# Altium schematic sheet Alimentacion.SchDoc: Fuente de alimentación
size A4; Address1: Medidor de energia PROSER; Address2: MEI-300V; DocumentNumber: 1; Revision: 01; SheetNumber: 1; SheetTotal: 6
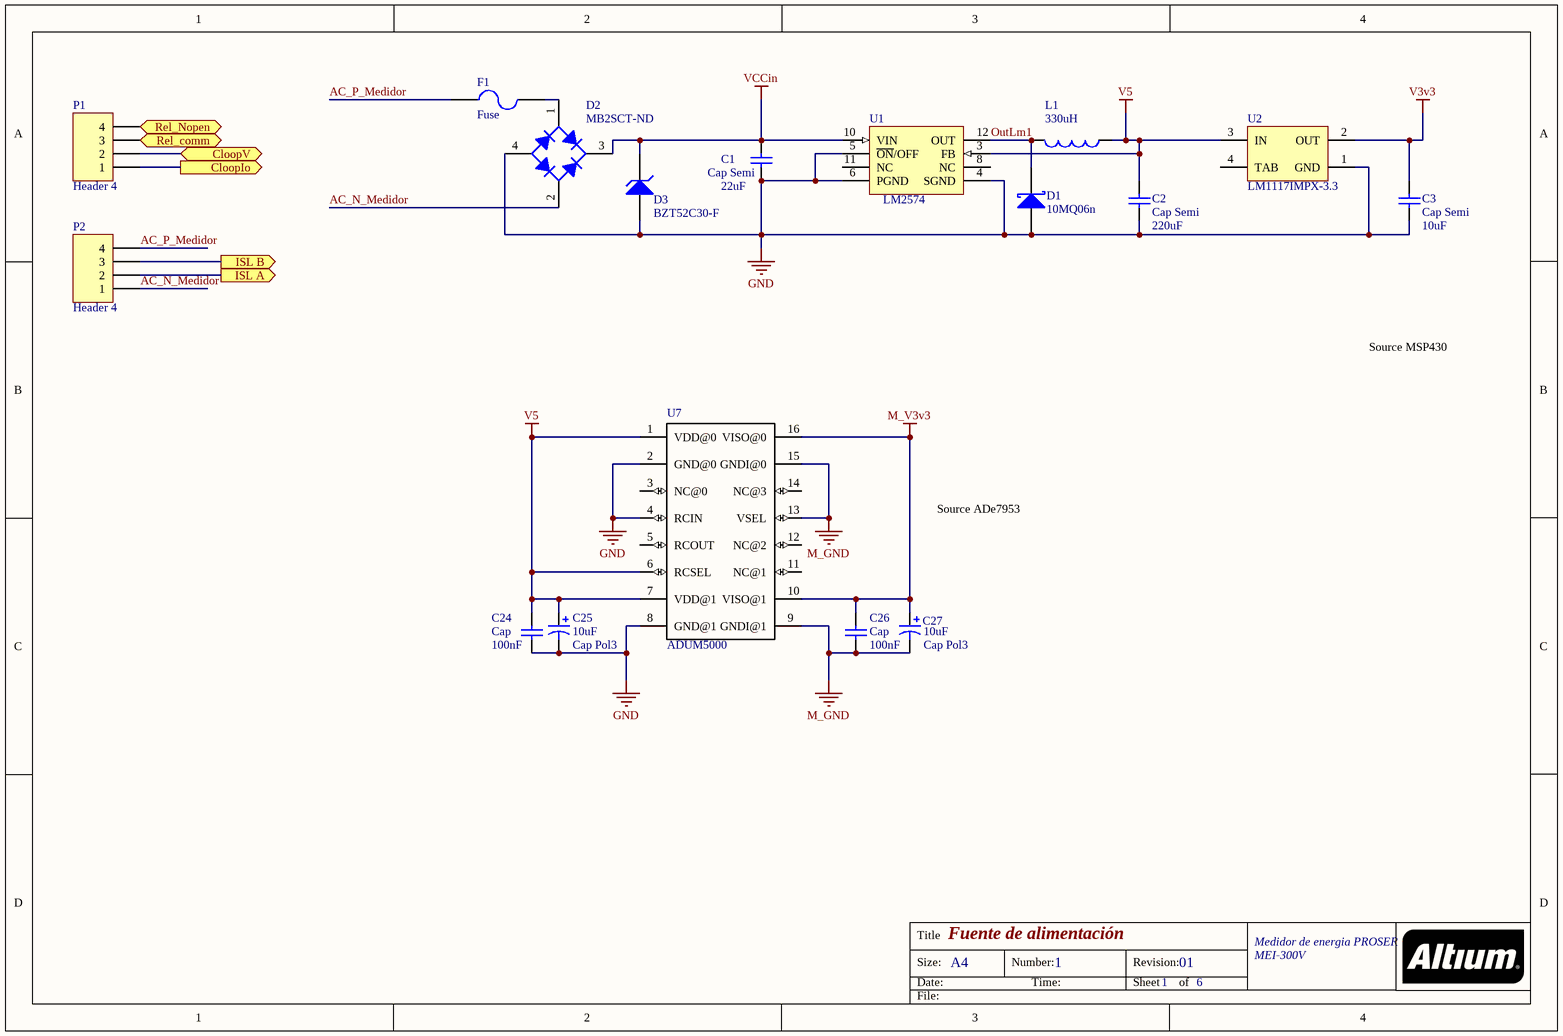
[diagram p0: Alimentacion.SchDoc]

## Parts
C1  Cap Semi  value 22uF  [7343]
C2  Cap Semi  value 220uF  [7343]
C3  Cap Semi  value 10uF  [3528]
C24  Cap  value 100nF  [Custom0805]
C25  Cap Pol3  value 10uF  [3528]
C26  Cap  value 100nF  [Custom0805]
C27  Cap Pol3  value 10uF  [3528]
D1  10MQ06n  [DO214]
D2  MB2SCT-ND  [SOIC4_M]
D3  BZT52C30-F  [1N4148W]
F1  Fuse  [SMD030F]
L1  value 330uH  [PE-526XXNL]  (hidden comment: Inductor)
P1  Header 4  [ConectorPrsr]
P2  Header 4  [ConectorPrsr]
U1  LM2574  [SOIC127P1033X264-14N]
U2  LM1117IMPX-3.3  [MP04A_N]
U7  ADUM5000  [*SO16W]

## Ports
CloopIo (out), CloopV, ISL A (out), ISL B (out), Rel_comm (out), Rel_Nopen (out)

## Nets
GND: C1.1 C2.1 C3.1 C24.1 C25.2 D1.1(A) D2.4(A) D3.1(A) U1.4(SGND) U1.5(~{ON}/OFF) U1.6(PGND) U2.1(GND) U7.2(GND@0) U7.4(RCIN) U7.8(GND@1)
M_GND: C26.1 C27.2 U7.9(GNDI@1) U7.13(VSEL) U7.15(GNDI@0)
M_V3v3: C26.2 C27.1 U7.10(VISO@1) U7.16(VISO@0)
V3v3: C3.2 U2.2(OUT)
V5: C2.2 C24.2 C25.1 L1.1 U1.3(FB) U2.3(IN) U7.1(VDD@0) U7.6(RCSEL) U7.7(VDD@1)
VCCin: C1.2 D2.3(K) D3.2(K) U1.10(VIN)
AC_N_Medidor: D2.2(C) P2.1
AC_P_Medidor: F1.1 P2.4
CloopIo: P1.1 ; port CloopIo
CloopV: P1.2 ; port CloopV
ISL A: P2.2 ; port ISL A
ISL B: P2.3 ; port ISL B
OutLm1: D1.2(K) L1.2 U1.12(OUT)
Rel_comm: P1.3 ; port Rel_comm
Rel_Nopen: P1.4 ; port Rel_Nopen
NetD2_1: D2.1(C) F1.2

Not connected (* = marked no-connect by the designer): U1 8(NC) 11(NC); U2 4(TAB); U7 3(NC@0) 5(RCOUT) 11(NC@1) 12(NC@2) 14(NC@3)

## Notes on the sheet
- Source MSP430
- Source ADe7953
- Title
- Size:
- Date:
- A4
- Number:
- Time:
- Revision:
- Sheet
- of
- File:

## Library data of the parts
C1-C3 = Cap Semi: Capacitor (Semiconductor SIM Model); Published: 8-Jun-2000; LatestRevisionDate: 29-May-2009; LatestRevisionNote: IPC-7351 Footprint Added.; PackageReference: C1206; Publisher: Altium Limited; PackageDescription: Chip Capacitor
C24 C26 = Cap: Capacitor; Published: 8-Jun-2000; LatestRevisionDate: 17-Jul-2002; LatestRevisionNote: Re-released for DXP Platform.; PackageReference: RAD-0.3; Publisher: Altium Limited; PackageDescription: Radial Cap, Thru-Hole; 2 Leads; 0.3 in Pin Spacing
C25 C27 = Cap Pol3: Polarized Capacitor (Surface Mount); Published: 8-Jun-2000; LatestRevisionDate: 29-May-2009; LatestRevisionNote: IPC-7351 Footprint Added.; PackageReference: C0805; Publisher: Altium Limited; PackageDescription: Chip Capacitor
D1 = D Schottky: Schottky Diode; Published: 8-Jun-2000; LatestRevisionDate: 17-Jul-2002; LatestRevisionNote: Re-released for DXP Platform.; PackageReference: SMB; Publisher: Altium Limited; PackageDescription: DO-214-AA/SMB; 2 C-Bend Leads; Body 5.3 x 3.6 mm, inc. leads (LxW); Code_JEDEC: DO-214-AA
D2 = Bridge1: Full Wave Diode Bridge - MB2S; Published: 8-Jun-2000; LatestRevisionDate: 29-May-2009; LatestRevisionNote: Sch pins A & K swapped.; DatasheetVersion: E2732B; PackageReference: D-38; Publisher: Altium Limited; PackageDescription: Bridge Rectifier; 4 Terminals; Body 9.4 x 9.4 mm (typ); Pitch 5.08 mm
D3 = D Zener: Zener Diode SMD; Published: 8-Jun-2000; LatestRevisionDate: 17-Jul-2002; LatestRevisionNote: Re-released for DXP Platform.; PackageReference: DIODE-0.7; Publisher: Altium Limited; PackageDescription: Diode, Thru-Hole; 2 Leads; 0.7 in Pin Spacing
F1 = Fuse 2: SMD030-2CT-ND; Published: 8-Jun-2000; LatestRevisionDate: 17-Jul-2002; LatestRevisionNote: Re-released for DXP Platform.; PackageReference: PIN-W2/E2.8; Publisher: Altium Limited; PackageDescription: Thru-Hole; 2 Leads
L1 = Inductor: PE52627NL; Code_IEC: 1005; Published: 8-Jun-2000; LatestRevisionDate: 29-May-2009; LatestRevisionNote: IPC-7351 Footprint Added.; PackageReference: 0402-A; Publisher: Altium Limited; PackageDescription: Chip Inductor; Code_JEITA: 0402
P1 P2 = Header 4: Header, 4-Pin; LatestRevisionDate: 17-Jul-2002; LatestRevisionNote: Re-released for DXP Platform.; Publisher: Altium Limited
U1 = LM2574N-5: Easy Switcher 0.5A Step-Down Voltage Regulator; Published: 15-Apr-2002; DatasheetVersion: Jul-1999; PackageVersion: 1998; PackageReference: 626-05; Publisher: Altium Limited; PackageDescription: DIP; 8 Leads; Row Spacing 7.62 mm; Pitch 2.54 mm; ComponentLink1Description: Manufacturer Link; ComponentLink1URL: http://www.onsemi.com/site/products/taxonomy/0,4438,503,00.html; ComponentLink2Description: Datasheet; ComponentLink2URL: http://www.onsemi.com/pub/Collateral/LM2574-D.PDF
U2 = LM1117IMPX-3.3: 800mA Low-Dropout Linear Regulator, 4-pin SOT-223; Manufacturer: National Semiconductor; PackageTopMarking: XYTT*N05B; PowerWise: N; CompType: LDO IC; Published: 1-Mar-2010; DatasheetVersion: Apr-2006; PackageVersion: revB, Apr-2003; PackageReference: MP04A; Publisher: Altium Limited; PackageDescription: Molded SOT-223, 6.50 x 3.56 x 1.6mm Body, 4 Lead, 2.3mm Pitch; PartNumber: LM1117IMPX-3.3; RoHS: N; PinCount: 4; Code_JEDEC: TO-261-AA; Code_IPC: SOT223-4; ComponentLink1Description: LM1117 Datasheet; ComponentLink1URL: http://www.national.com/ds/LM/LM1117.pdf; ComponentLink2Description: LM1117 Web Page; ComponentLink2URL: http://www.national.com/pf/LM/LM1117.html; ComponentLink3Description: MP04A Package Page; ComponentLink3URL: http://www.national.com/packaging/folders/mp04a.html
U7 = ADUM5000: ADI Isolated DC/DC Converter; MF: Analog Devices; SnapEDA_Link: https://www.snapeda.com/parts/ADUM5000/Analog%20Devices%20Inc./view-part/?ref=snap; Price: None; Availability: Unavailable; MP: ADUM5000; Package: None; Value: *